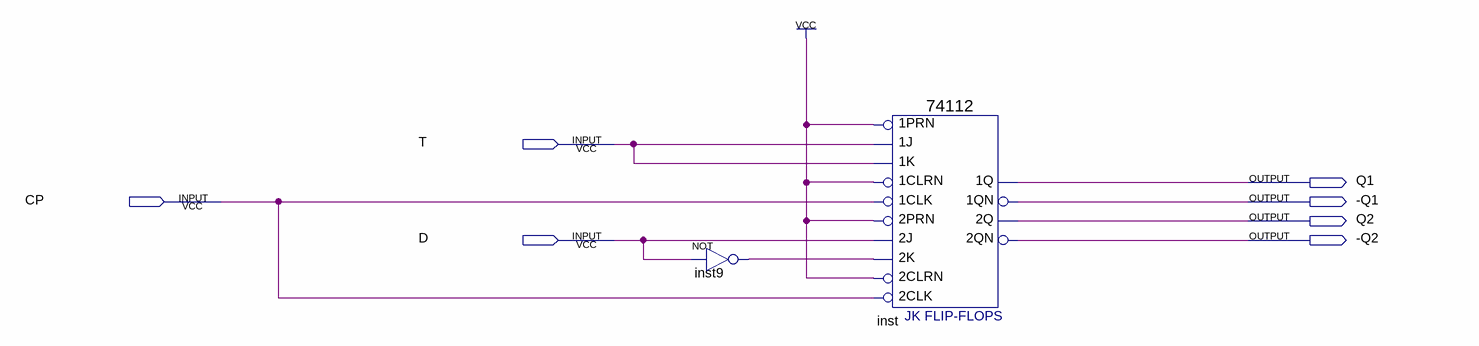
[diagram p0: schematic sheet]
// Quartus schematic 74LS112_T_D.bdf as structural Verilog: 2 symbols, 7 pins
module \74LS112_T_D  (
  input  T,
  input  CP,
  input  D,
  output Q1,
  output \-Q1 ,
  output Q2,
  output \-Q2 
);

  wire inst9_out;

  not inst9 (inst9_out, D);
  \74112  inst (
    .\1K (T), .\1J (T), .\1PRN (1'b1), .\1CLK (CP), .\1CLRN (1'b1), .\2K (inst9_out), .\2J (D),
    .\2PRN (1'b1), .\2CLK (CP), .\2CLRN (1'b1), .\1QN (\-Q1 ), .\2Q (Q2), .\1Q (Q1), .\2QN (\-Q2 ));
endmodule
